# EAGLE design airu-schematic-bb-v1 (EAGLE 7.1.0)
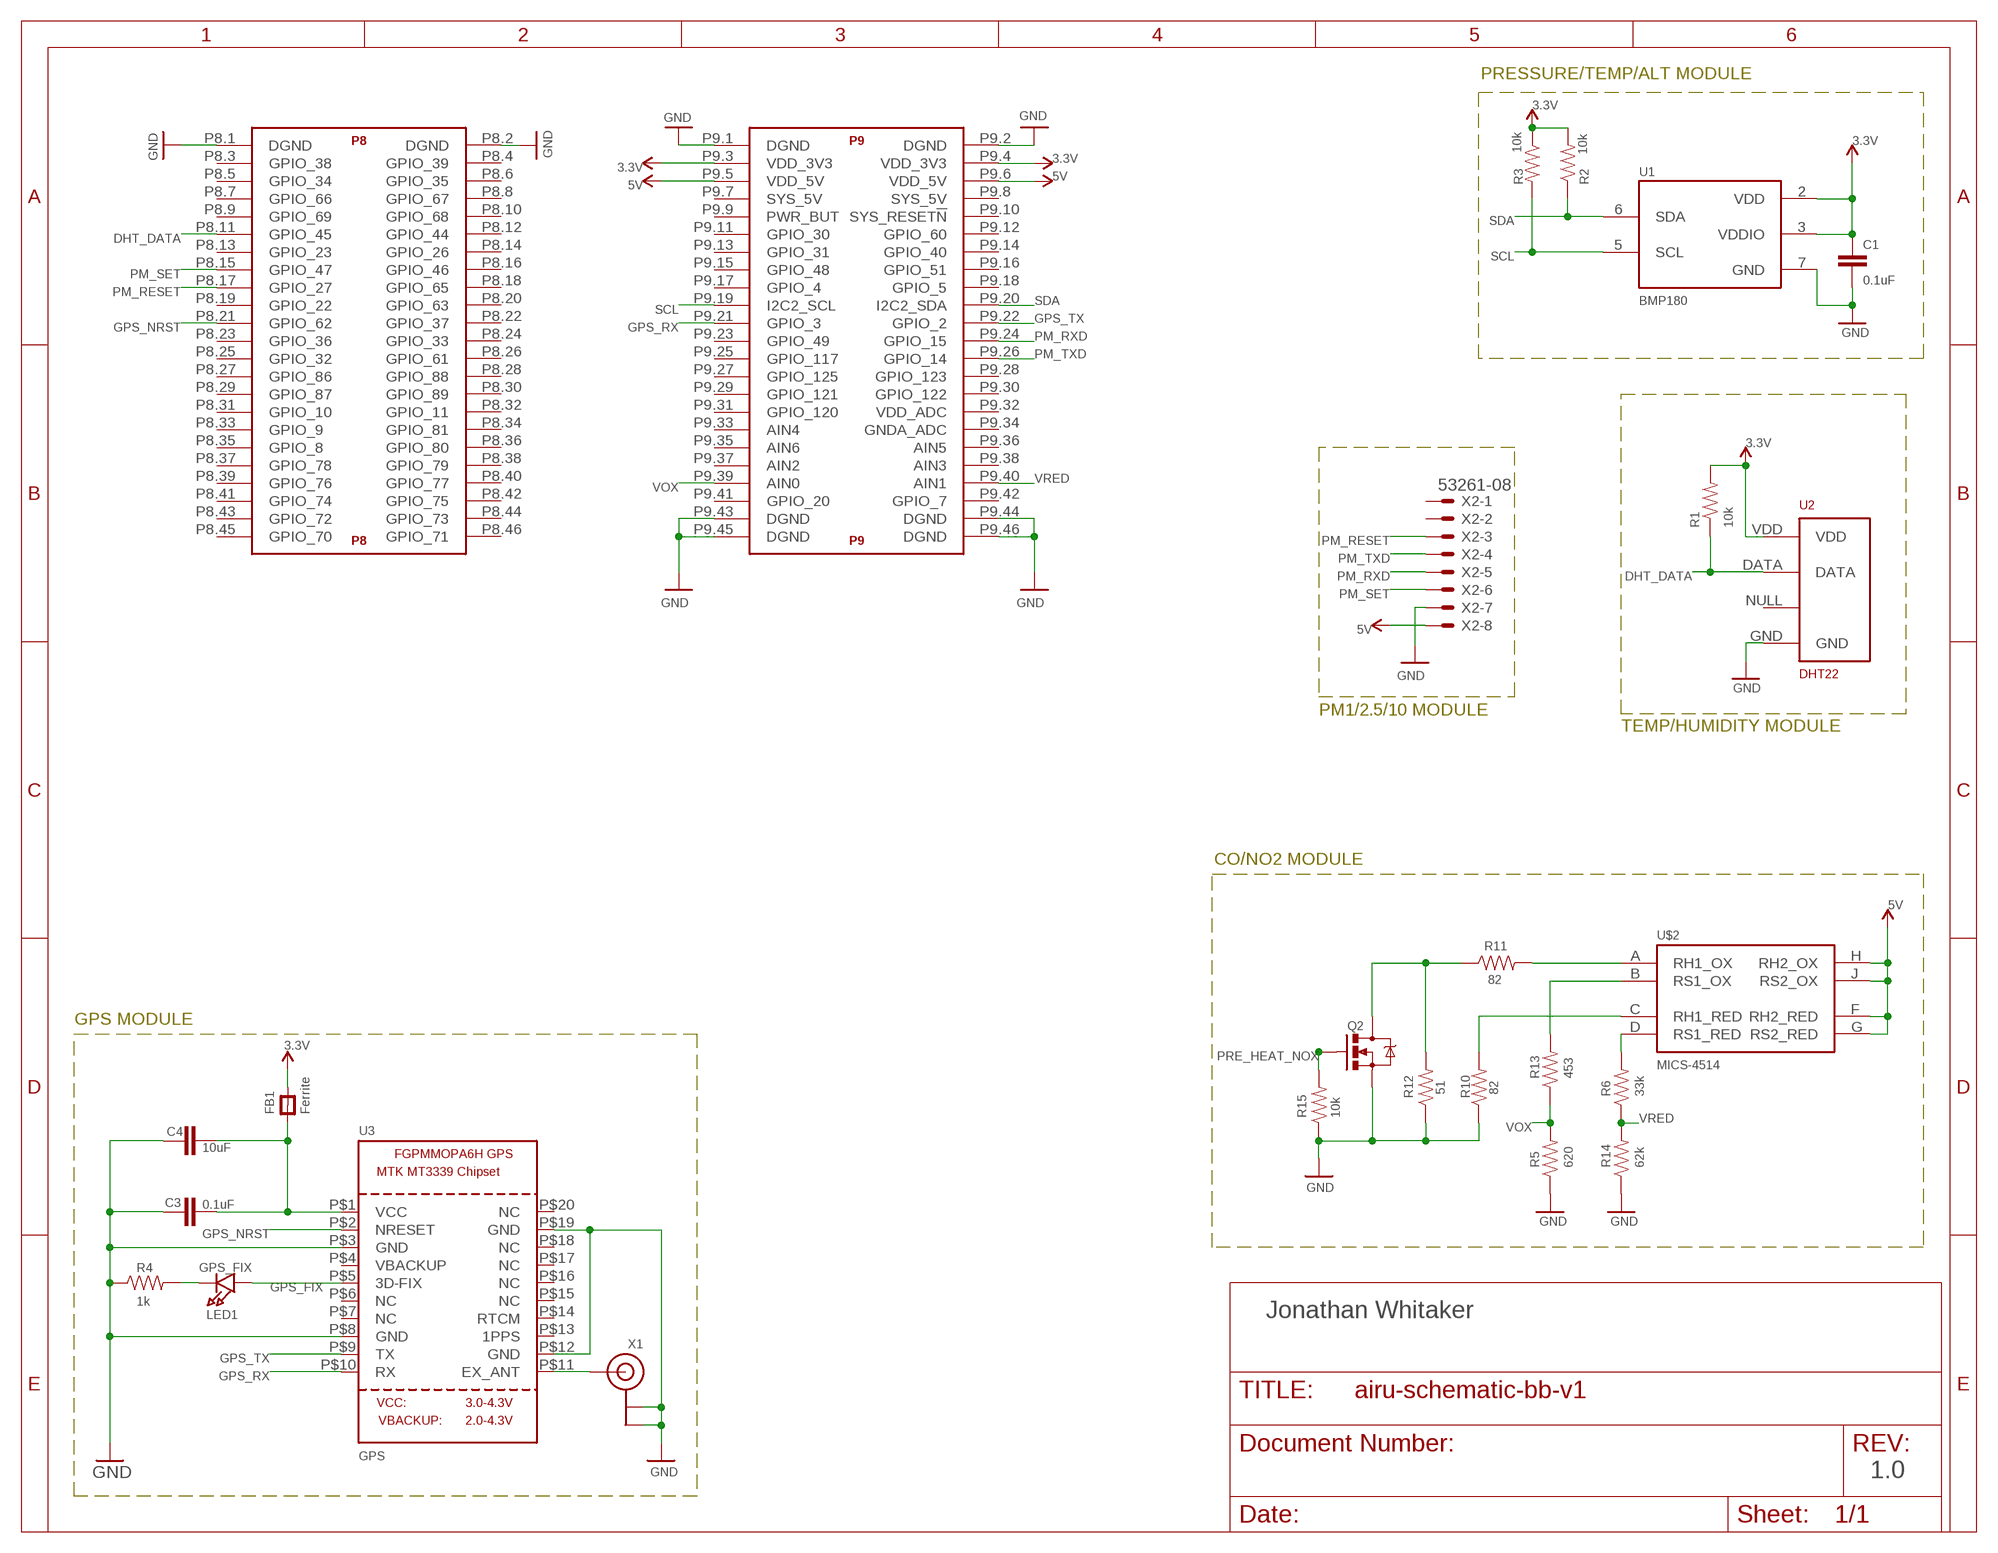
[diagram p0: schematic, sheet 1]

## Parts
C1  0.1uF  CAP1206  [1206]
C3  0.1uF  CAP1206  [1206]
C4  10uF  CAP1206  [1206]
FB1  Ferrite  FERRITE0805  [0805]
LED1  GPS_FIX  LED1206  [CHIPLED_1206]
Q2  MOSFET-NCHANNELAO3404A  [SOT23-3]
R1  10k  RESISTOR1206  [1206]
R2  10k  RESISTOR1206  [1206]
R3  10k  RESISTOR1206  [1206]
R4  1k  RESISTOR1206  [1206]
R5  620  RESISTOR1206  [1206]
R6  33k  RESISTOR1206  [1206]
R10  82  RESISTOR1206  [1206]
R11  82  RESISTOR1206  [1206]
R12  51  RESISTOR1206  [1206]
R13  453  RESISTOR1206  [1206]
R14  62k  RESISTOR1206  [1206]
R15  10k  RESISTOR1206  [1206]
U1  BMP180  [BMP180]
U2  DHT22  RHT03_DHT-22_AM2302  [RHT03_DHT-22]
U3  GPS  GPS_FGPMMOPA6H  [FGPMMOPA6H]
U$1  BEAGLE_BONE_BLACK_CAPE  [BEAGLE_BONE_BLACK_CAPE]
U$2  MICS-4514  [MICS_10-SMD]
X1  ANTENNA_U.FL  [U.FL]
X2  53261-08  [53261-08]

## Nets
3.3V: C1.1 FB1.2 R1.2 R2.2 R3.1 U1.2(VDD) U1.3(VDDIO) U2.VDD U$1.P9.3(P9:VDD_3V3) U$1.P9.4(P9:VDD_3V3) ; supply symbol labelled VCC
5V: U$1.P9.5(P9:VDD_5V) U$1.P9.6(P9:VDD_5V) U$2.F(RH2_RED) U$2.G(RS2_RED) U$2.H(RH2_OX) U$2.J(RS2_OX) X2.8 ; supply symbol labelled VCC
DHT_DATA [DHT22 GND]: R1.1 U2.DATA U$1.P8.11(P8:GPIO_45)
GND [DHT22 GND]: C1.2 C3.1 C4.1 Q2.2(S) R4.1 R5.1 R10.1 R12.1 R14.1 R15.1 U1.7(GND) U2.GND U3.P$3(GND) U3.P$8(GND) U3.P$12(GND) U3.P$19(GND) U$1.P8.1(P8:DGND) U$1.P8.2(P8:DGND) U$1.P9.1(P9:DGND) U$1.P9.2(P9:DGND) U$1.P9.43(P9:DGND) U$1.P9.44(P9:DGND) U$1.P9.45(P9:DGND) U$1.P9.46(P9:DGND) X1.1(GND) X1.2(GND) X2.7
GPS_FIX: LED1.A U3.P$5(3D-FIX)
GPS_NRST: U3.P$2(NRESET) U$1.P8.21(P8:GPIO_62)
GPS_RX: U3.P$10(RX) U$1.P9.21(P9:GPIO_3)
GPS_TX: U3.P$9(TX) U$1.P9.22(P9:GPIO_2)
N$1: C3.2 C4.2 FB1.1 U3.P$1(VCC)
N$2: U3.P$11(EX_ANT) X1.3(SIGNAL)
N$3: LED1.C R4.2
N$4: R10.2 U$2.C(RH1_RED)
N$6: R13.2 U$2.B(RS1_OX)
N$7: Q2.3(D) R11.1 R12.2
N$8: R6.2 U$2.D(RS1_RED)
N$9: R11.2 U$2.A(RH1_OX)
PM_RESET: U$1.P8.17(P8:GPIO_27) X2.3
PM_RXD: U$1.P9.24(P9:GPIO_15) X2.5
PM_SET: U$1.P8.15(P8:GPIO_47) X2.6
PM_TXD: U$1.P9.26(P9:GPIO_14) X2.4
PRE_HEAT_NOX: Q2.1(G) R15.2
SCL: R3.2 U1.5(SCL) U$1.P9.19(P9:I2C2_SCL)
SDA [BMP180 SCL/SDA]: R2.1 U1.6(SDA) U$1.P9.20(P9:I2C2_SDA)
VOX: R5.2 R13.1 U$1.P9.39(P9:AIN0)
VRED: R6.1 R14.2 U$1.P9.40(P9:AIN1)
Unconnected: U2.NULL U3.P$4(VBACKUP) U3.P$6(NC) U3.P$7(NC) U3.P$13(1PPS) U3.P$14(RTCM) U3.P$15(NC) U3.P$16(NC) U3.P$17(NC) U3.P$18(NC) U3.P$20(NC) U$1.P8.3(P8:GPIO_38) U$1.P8.4(P8:GPIO_39) U$1.P8.5(P8:GPIO_34) U$1.P8.6(P8:GPIO_35) U$1.P8.7(P8:GPIO_66) U$1.P8.8(P8:GPIO_67) U$1.P8.9(P8:GPIO_69) U$1.P8.10(P8:GPIO_68) U$1.P8.12(P8:GPIO_44) U$1.P8.13(P8:GPIO_23) U$1.P8.14(P8:GPIO_26) U$1.P8.16(P8:GPIO_46) U$1.P8.18(P8:GPIO_65) U$1.P8.19(P8:GPIO_22) U$1.P8.20(P8:GPIO_63) U$1.P8.22(P8:GPIO_37) U$1.P8.23(P8:GPIO_36) U$1.P8.24(P8:GPIO_33) U$1.P8.25(P8:GPIO_32) U$1.P8.26(P8:GPIO_61) U$1.P8.27(P8:GPIO_86) U$1.P8.28(P8:GPIO_88) U$1.P8.29(P8:GPIO_87) U$1.P8.30(P8:GPIO_89) U$1.P8.31(P8:GPIO_10) U$1.P8.32(P8:GPIO_11) U$1.P8.33(P8:GPIO_9) U$1.P8.34(P8:GPIO_81) U$1.P8.35(P8:GPIO_8) U$1.P8.36(P8:GPIO_80) U$1.P8.37(P8:GPIO_78) U$1.P8.38(P8:GPIO_79) U$1.P8.39(P8:GPIO_76) U$1.P8.40(P8:GPIO_77) U$1.P8.41(P8:GPIO_74) U$1.P8.42(P8:GPIO_75) U$1.P8.43(P8:GPIO_72) U$1.P8.44(P8:GPIO_73) U$1.P8.45(P8:GPIO_70) U$1.P8.46(P8:GPIO_71) U$1.P9.7(P9:SYS_5V) U$1.P9.8(P9:SYS_5V) U$1.P9.9(P9:PWR_BUT) U$1.P9.10(P9:SYS_RESET!N) U$1.P9.11(P9:GPIO_30) U$1.P9.12(P9:GPIO_60) U$1.P9.13(P9:GPIO_31) U$1.P9.14(P9:GPIO_40) U$1.P9.15(P9:GPIO_48) U$1.P9.16(P9:GPIO_51) U$1.P9.17(P9:GPIO_4) U$1.P9.18(P9:GPIO_5) U$1.P9.23(P9:GPIO_49) U$1.P9.25(P9:GPIO_117) U$1.P9.27(P9:GPIO_125) U$1.P9.28(P9:GPIO_123) U$1.P9.29(P9:GPIO_121) U$1.P9.30(P9:GPIO_122) U$1.P9.31(P9:GPIO_120) U$1.P9.32(P9:VDD_ADC) U$1.P9.33(P9:AIN4) U$1.P9.34(P9:GNDA_ADC) U$1.P9.35(P9:AIN6) U$1.P9.36(P9:AIN5) U$1.P9.37(P9:AIN2) U$1.P9.38(P9:AIN3) U$1.P9.41(P9:GPIO_20) U$1.P9.42(P9:GPIO_7) X2.1 X2.2

## Notes on the sheet
- PRESSURE/TEMP/ALT MODULE
- PM1/2.5/10 MODULE
- TEMP/HUMIDITY MODULE
- CO/NO2 MODULE
- GPS MODULE
- Jonathan Whitaker
- 1.0

## Library data of the parts
C1 C3 C4 = SparkFun-Passives:CAP: Capacitor Standard 0603 ceramic capacitor, and 0.1" leaded capacitor.
FB1 = microbuilder:FERRITE: Ferrite Bead 0603 MMZ1608B121C - 120 Ohm @ 100MHz, 600mA, 0.15 Ohm DC Resistance - Digikey: 445-2164-1-ND BK1608HW121-T - 120 Ohm, 600mA Ferrite Chip - Digikey: 587-1876-2-ND 0805 HZ0805B272R-10 - 2.7K Ohm @ 100MHz, 200mA, 0.8 Ohm DC Resistance - Digikey: 240-2504-1-ND (see also Murata BLM21BD272SN1L) MMZ2012Y152B - 1.5K Ohm @ 100MHz, 500mA, 0.4 Ohm DC Resistance - Digikey: 445-1560-1-ND - Mainly for high frequency (80-400MHz) MMZ2012R102A - 1K Ohm @ 100MHz, 500mA, 0.3 Ohm DC Resistance - Digikey: 445-1555-2-ND - More general purpose (10-200MHz)
LED1 = microbuilder:LED: LED 0603 - 0603 Surface Mount Package 2mA: Green LED - Low Power (3.9mcd, 2ma, 1.7Vf) - Digikey: 475-2709-2-ND Orange LED - Low Power (9.8mcd, 2ma, 1.8Vf) - Digikey: 475-1194-2-ND Red LED - Low Power (5mcd, 2ma, 1.8Vf) - Digikey: 475-1195-2-ND Yellow LED - Low Power (7mcd, 2ma, 1.8Vf) - Digikey: 475-1196-2-ND 5mA: Blue LED - Low Power (17mcd, 5ma, 2.9Vf) - Digikey: LNJ937W8CRACT-ND 0805 - 0805 Surface Mount Package 2mA: Red LED (8.8mcd, 2mA, 1.8Vf, Clear) - Low Power [Digikey: 475-2510-1-ND] Green LED (5mcd, 2mA, 1.8Vf, Clear) - Low Power [Digikey: 475-2730-1-ND] Yellow LED (11.3mcd, 2mA, 1.8Vf, Clear) - Low Power [Digikey: 475-2555-1-ND] 20mA: Red LED (104mcd, 20mA, Diffused) - LS R976 [Digikey: 475-1278-6-ND] Red LED (12mcd, 20mA, 2.0Vf, Clear) - APT2012EC [Digikey: 754-1128-1-ND] Green LED (15mcd, 20mA, 2.2Vf, Clear) - APT2012GC [Digikey: 754-1131-1-ND] Orange LED (160mcd, 20mA, 2.1Vf, Clear) - APT2012SECK [Digikey: 754-1130-1-ND] 1206 - 1206 Surface Mount Package Green LED (26mcd, 20mA, Diffused) - LG N971 [Digikey: 475-1407-6-ND] Red LED (15mcd, 20mA, Diffused) - LH N974 [Digikey: 475-1416-6-ND]
Q2 = SparkFun-DiscreteSemi:MOSFET-NCHANNEL: Common NMOSFET Parts MFG P/N Store ID Prod ID FDD8780 TRANS-09984 SI7820DN TRANS-11055 FDS6630A IC-08089 2N7002PW TRANS-11151 FQP30N06L COM-10213 TRANS-10060 BSS123LT1G TRANS-08345 BSS138 TRANS-00830 BS170 2N7000; PROD_ID: TRAN-12988
R1-R6 R10-R15 = SparkFun-Passives:RESISTOR: Resistor Basic schematic elements and footprints for 0603, 1206, and PTH resistors.
U1 = SparkFun-Sensors:BMP180: BOSCH BMP180 DIGITAL BAROMETRIC PRESSURE SENSOR Web page: http://www.bosch-sensortec.com/en/homepage/products_3/environmental_sensors_1/bmp180_1/bmp180 Datasheet: http://ae-bst.resource.bosch.com/media/products/dokumente/bmp180/BST-BMP180-DS000-09.pdf The BMP180 is the function compatible successor of the BMP085, a new generation of high precision digital pressure sensors for consumer applications. The ultra-low power, low voltage electronics of the BMP180 is optimized for use in mobile phones, PDAs, GPS navigation devices and outdoor equipment. With a low altitude noise of merely 0.25m at fast conversion time, the BMP180 offers superior performance. The I2C interface allows for easy system integration with a microcontroller. The BMP180 is based on piezo-resistive technology for EMC robustness, high accuracy and linearity as well as long term stability. Key features: - Temperature measurement included - I2C interface - Fully calibrated - Pb-free, halogen-free and RoHS compliant, - MSL 1 Basic specs: Pressure range: 300 to 1100hPa (+9000m to -500m relating to sea level) Supply voltage: 1.8 to 3.6V (VDD), 1.62V to 3.6V (VDDIO) Package: LGA package with metal lid Small footprint: 3.6mm x 3.8mm Super-flat: 0.93mm height Low power: 5μA at 1 sample / sec. in standard mode Low noise: 0.06hPa (0.5m) in ultra low power mode, 0.02hPa (0.17m) advanced resolution mode Typical applications: - Enhancement of GPS navigation (dead-reckoning, slope detection, etc.) - In- and out-door navigation - Leisure and sports - Weather forecast - Vertical velocity indication (rise/sink speed)
U2 = RHT03_DHT-22_AM2302:RHT03_DHT-22_AM2302: RHT03 / DHT-22 / AM2302 Packages and symbol for the RHT03 / DHT-22 relative humidity and temperature sensor. Note: The AM2302 is a wired version of the DHT-22 which typically requires less clearance and is thus provided as a separate package.; PROD_ID: SEN-10167
U3 = adafruit:GPS_FGPMMOPA6H: GPS Module - MTK MT3339 Chipset, -165dBm sensitivity, 22 channels, 10Hz, auto-select external antenna options
U$1 = SparkFun-Boards:BEAGLE_BONE_BLACK_CAPE
U$2 = SparkFun-Sensors:MICS-4514: Metal oxide MEMS carbon monoxide (CO) and NOx sensor in an SMD package.; PROD_ID: COMP-12310
X1 = adafruit:ANTENNA_U.FL: U.FL Antenna Connector
X2 = con-molex:53?-08: CONNECTOR wire to board 1.25 mm (.049 inch) pitch header; OC_FARNELL: 1125376; OC_NEWARK: unknown

## Net classes
0 default: width 0.254 mm
1 ground: width 0.457 mm
2 vcc: width 0.457 mm
3 BMP180 GND: width 0.152 mm, clearance 0.152 mm
4 BMP180 SCL/SDA: width 0.127 mm, clearance 0.127 mm
5 DHT22 GND: width 0.003 mm, clearance 0.127 mm

## Board
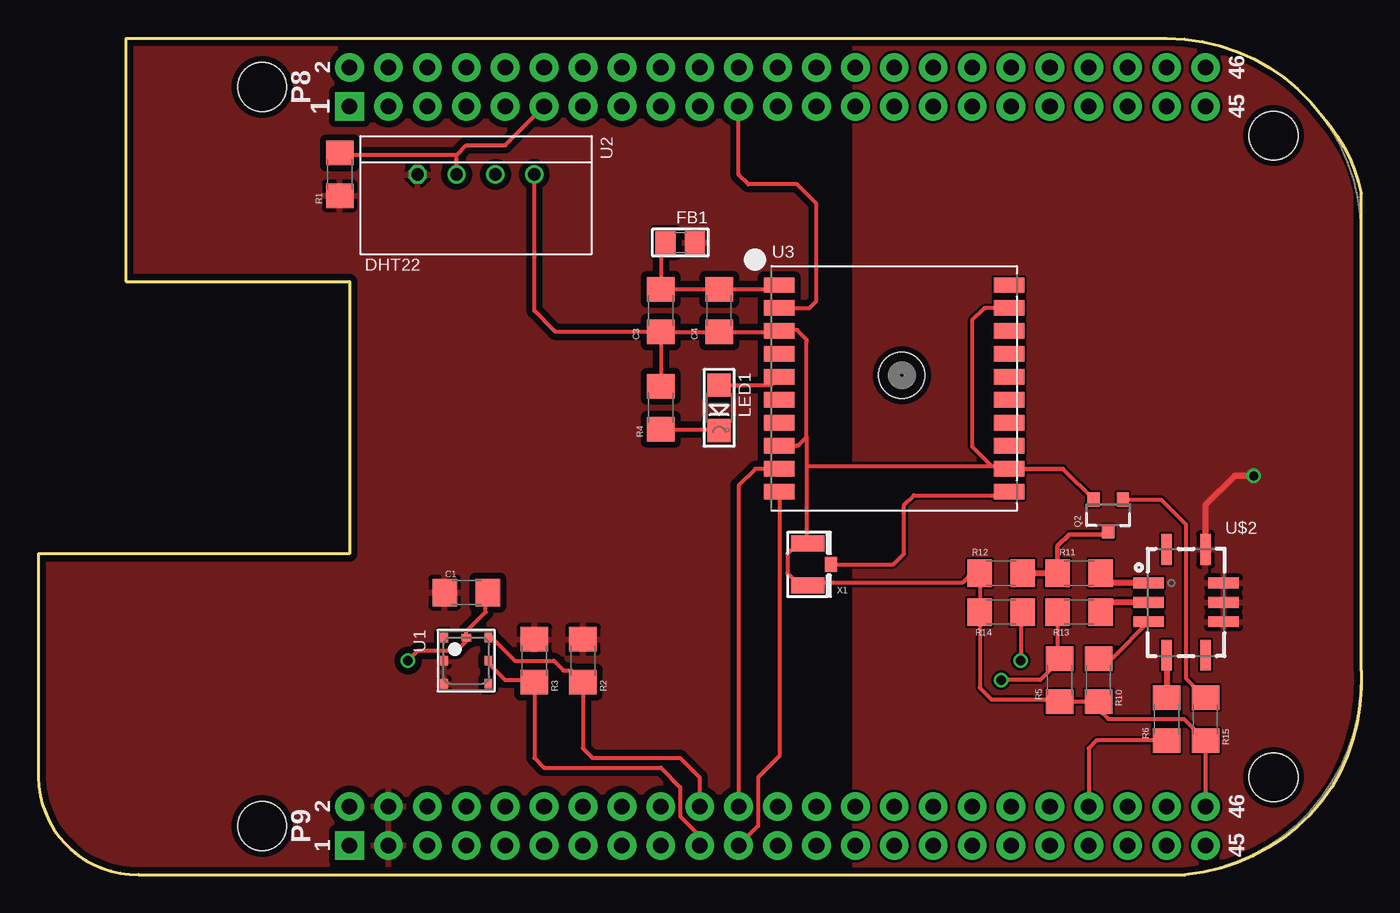
[diagram p1: board, top side]
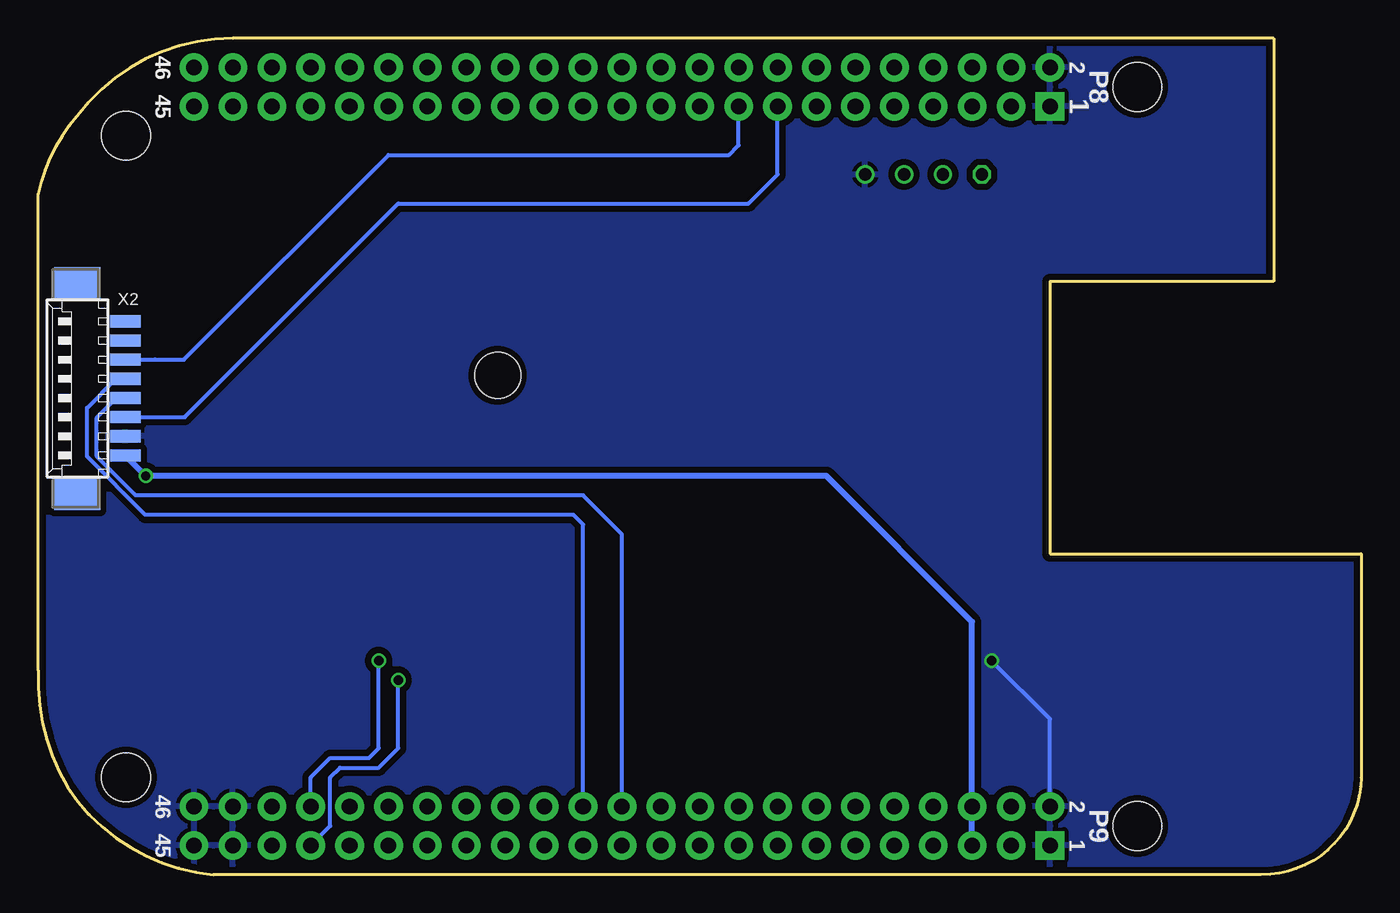
[diagram p2: board, bottom side, seen from below]

Size 86.37 x 54.61 mm. Coordinates in mm from the lower left corner, seen from the top.
Outline: 5.71,54.61 5.71,38.73 20.32,38.73 20.32,20.95 0,20.95 0,6.35 arc90 6.54,0 74.93,0 arc51 84.45,5.71 arc33 86.36,13.34 86.36,44.45 arc30 83.82,49.53 arc53 73.66,54.61 5.71,54.61
Copper layers (1*16): Top 0.0356mm / dielectric 1.5011mm / Bottom 0.0356mm
Design rules "osh-park": minimum track width 6mil, minimum drill 13mil, track to track 6mil, track to pad 6mil, pad to pad 6mil, via to via 6mil, smd to smd 6mil, copper to edge 15mil, drill to drill 6mil, minimum pad ring 7mil, minimum via ring 7mil, stop-mask expansion 3mil, vias tented up to drill 0mil, thermal gap 10mil

### Footprints (pad centres in the part's own frame; a part is rotated, then mirrored left to right if it is on the bottom)
1206 = smd 1.6 x 1.8: 1 -1.4,0; 2 1.4,0
0805 = smd 1.3 x 1.5: 1 -0.95,0; 2 0.95,0
CHIPLED_1206 = smd 1.5 x 1.5: A 0,-1.496; C 0,1.496
SOT23-3 = smd 0.8 x 0.9: 1 -0.95,-1; 2 0.95,-1; 3 0,1.1
BMP180 = smd 0.6 x 0.5: 1 1.5,1.45; 2 0,1.45; 3 -1.5,1.45; 4 -1.5,-1.45; 5 0,-1.45; 6 1.5,-1.45 | smd 0.5 x 0.6: 7 1.5,0
RHT03_DHT-22 = drill 0.8: DATA -1.27,0; GND 3.81,0; NULL 1.27,0 | drill 0.8 octagon: VDD -3.81,0
FGPMMOPA6H = smd 2 x 1: P$1 -7.5,6.75; P$2 -7.5,5.25; P$3 -7.5,3.75; P$4 -7.5,2.25; P$5 -7.5,0.75; P$6 -7.5,-0.75; P$7 -7.5,-2.25; P$8 -7.5,-3.75; P$9 -7.5,-5.25; P$10 -7.5,-6.75; P$11 7.5,-6.75; P$12 7.5,-5.25; P$13 7.5,-3.75; P$14 7.5,-2.25; P$15 7.5,-0.75; P$16 7.5,0.75; P$17 7.5,2.25; P$18 7.5,3.75; P$19 7.5,5.25; P$20 7.5,6.75 | hole 3: 0.5,0.85
BEAGLE_BONE_BLACK_CAPE = drill 1.016 pad 1.88 square: P8.1 20.32,50.165; P9.1 20.32,1.905 | drill 1.016 pad 1.88: P8.2 20.32,52.705; P8.3 22.86,50.165; P8.4 22.86,52.705; P8.5 25.4,50.165; P8.6 25.4,52.705; P8.7 27.94,50.165; P8.8 27.94,52.705; P8.9 30.48,50.165; P8.10 30.48,52.705; P8.11 33.02,50.165; P8.12 33.02,52.705; P8.13 35.56,50.165; P8.14 35.56,52.705; P8.15 38.1,50.165; P8.16 38.1,52.705; P8.17 40.64,50.165; P8.18 40.64,52.705; P8.19 43.18,50.165; P8.20 43.18,52.705; P8.21 45.72,50.165; P8.22 45.72,52.705; P8.23 48.26,50.165; P8.24 48.26,52.705; P8.25 50.8,50.165; P8.26 50.8,52.705; P8.27 53.34,50.165; P8.28 53.34,52.705; P8.29 55.88,50.165; P8.30 55.88,52.705; P8.31 58.42,50.165; P8.32 58.42,52.705; P8.33 60.96,50.165; P8.34 60.96,52.705; P8.35 63.5,50.165; P8.36 63.5,52.705; P8.37 66.04,50.165; P8.38 66.04,52.705; P8.39 68.58,50.165; P8.40 68.58,52.705; P8.41 71.12,50.165; P8.42 71.12,52.705; P8.43 73.66,50.165; P8.44 73.66,52.705; P8.45 76.2,50.165; P8.46 76.2,52.705; P9.2 20.32,4.445; P9.3 22.86,1.905; P9.4 22.86,4.445; P9.5 25.4,1.905; P9.6 25.4,4.445; P9.7 27.94,1.905; P9.8 27.94,4.445; P9.9 30.48,1.905; P9.10 30.48,4.445; P9.11 33.02,1.905; P9.12 33.02,4.445; P9.13 35.56,1.905; P9.14 35.56,4.445; P9.15 38.1,1.905; P9.16 38.1,4.445; P9.17 40.64,1.905; P9.18 40.64,4.445; P9.19 43.18,1.905; P9.20 43.18,4.445; P9.21 45.72,1.905; P9.22 45.72,4.445; P9.23 48.26,1.905; P9.24 48.26,4.445; P9.25 50.8,1.905; P9.26 50.8,4.445; P9.27 53.34,1.905; P9.28 53.34,4.445; P9.29 55.88,1.905; P9.30 55.88,4.445; P9.31 58.42,1.905; P9.32 58.42,4.445; P9.33 60.96,1.905; P9.34 60.96,4.445; P9.35 63.5,1.905; P9.36 63.5,4.445; P9.37 66.04,1.905; P9.38 66.04,4.445; P9.39 68.58,1.905; P9.40 68.58,4.445; P9.41 71.12,1.905; P9.42 71.12,4.445; P9.43 73.66,1.905; P9.44 73.66,4.445; P9.45 76.2,1.905; P9.46 76.2,4.445 | hole 3.175: 14.605,3.175; 80.645,6.35; 80.645,48.26; 14.605,51.435
MICS_10-SMD = smd 0.7 x 2: A 1.27,2.45; B 0,2.45; C -1.27,2.45; F -1.27,-2.45; G 0,-2.45; H 1.27,-2.45 | smd 2 x 0.7: D -3.45,1.27; E -3.45,-1.27; J 3.45,-1.27; K 3.45,1.27
U.FL = smd 2.2 x 1.05: 1 0,1.375; 2 0,-1.375 | smd 0.8 x 1: 3 1.525,0
53261-08 = smd 0.8 x 2: 1 4.375,-2.5; 2 3.125,-2.5; 3 1.875,-2.5; 4 0.625,-2.5; 5 -0.625,-2.5; 6 -1.875,-2.5; 7 -3.125,-2.5; 8 -4.375,-2.5 | smd 2.1 x 3: S1 6.875,0.625; S2 -6.875,0.625

### Placement (x,y rotation side)
C1  27.94,18.41 0 top
C3  40.64,36.83 90 top
C4  44.45,36.83 90 top
FB1  41.91,41.27 0 top
LED1  44.45,30.48 180 top
Q2  69.85,23.5 180 top
R1  19.68,45.72 270 top
R2  35.56,13.97 90 top
R3  32.38,13.97 270 top
R4  40.64,30.48 270 top
R5  66.67,12.7 90 top
R6  73.66,10.16 90 top
R10  69.22,12.7 90 top
R11  67.94,19.68 0 top
R12  62.87,19.68 0 top
R13  67.94,17.14 0 top
R14  62.87,17.14 0 top
R15  76.2,10.16 90 top
U1  27.94,13.97 90 top
U2  28.57,45.72 0 top
U3  55.88,31.75 0 top
U$1  0,0 0 top
U$2  74.93,17.78 90 top
X1  50.23,20.26 0 top
X2  83.19,31.75 90 bottom

### Tracks (layer width: path | path; a pad name or v marks a point on that pad's centre or on a via)
3.3V
  pour Top (isolate 0.406): 0,54.61 52.07,54.61 52.07,0 0,0
5V  (via drill 0.6)
  Top 0.406: v79.34,26.04 78.11,26.04 76.2,24.13 U$2.J
  Bottom 0.406: U$1.P9.6 25.4,3.81 | U$1.P9.6 25.4,5.08 25.4,16.51 34.92,26.04 v79.34,26.04 X2.8 | U$1.P9.5 U$1.P9.6
  pour Top: 53.34,54.61 86.36,54.61 86.36,0 53.34,0
DHT_DATA
  Top 0.254: U2.DATA 27.3,46.99 | 27.3,46.99 27.94,47.62 30.48,47.62 U$1.P8.11 | 27.3,46.99 19.82,46.99 R1.1
GND  (via drill 0.6)
  Top 0.254: v24.13,13.97 24.77,14.61 27.3,14.61 27.94,15.24 U1.7 27.94,15.88 29.21,17.14 29.21,18.29 C1.2 | C3.1 C4.1 48.31,35.43 arc90 U3.P$3 arc-45 48.52,35.56 49.53,35.56 50.09,35 arc-45 50.16,34.82 50.16,28.57 | C3.1 33.89,35.43 arc-45 33.71,35.5 32.38,36.83 U2.GND | C3.1 R4.1 | U3.P$8 49.48,28 arc45 49.66,28.07 50.16,28.57 | U3.P$19 61.87,37 arc45 61.69,36.93 60.96,36.2 60.96,28.05 arc45 61.03,27.87 62.23,26.67 | 62.23,26.67 63.1,26.67 | 63.1,26.67 arc-45 63.28,26.6 | 62.23,26.67 50.23,26.67 50.16,26.61 | 63.1,26.67 arc-45 63.28,26.6 | 63.28,26.6 U3.P$12 | 66.89,26.5 Q2.2 68.53,24.13 | U$1.P9.46 R15.1 74.8,10.16 69.85,10.16 69.22,10.79 R10.1 R5.1 66.55,11.43 62.23,11.43 61.47,12.2 R14.1 R12.1 60.96,19.68 60.33,19.05 50.4,19.05 X1.2 50.06,19.05 49.53,19.05 48.9,19.68 48.9,20.95 49.57,21.63 X1.1 50.16,21.7 50.16,26.61 | 50.16,28.57 50.16,26.61
  Top 0.305: U3.P$12 66.89,26.5
  Bottom 0.254: U$1.P9.2 20.32,10.16 v24.13,13.97
  pour Bottom (isolate 0.406): 0,54.61 86.36,54.61 86.36,0 0,0
GPS_FIX
  Top 0.254: LED1.A 47.86,31.98 U3.P$5
GPS_NRST
  Top 0.254: U3.P$2 50.34,37 50.8,37.47 50.8,43.81 49.53,45.09 46.35,45.09 45.72,45.72 U$1.P8.21
GPS_RX
  Top 0.254: U3.P$10 48.38,7.74 46.99,6.35 46.99,3.17 U$1.P9.21
GPS_TX
  Top 0.254: U3.P$9 46.82,26.5 45.72,25.4 U$1.P9.22
N$1
  Top 0.254: FB1.1 40.89,41.27 arc90 40.64,41.02 C3.2 C4.2 48.13,38.23 arc90 48.38,38.48 U3.P$1
N$2
  Top 0.254: U3.P$11 63.15,24.77 57.15,24.77 56.52,24.13 56.52,20.95 55.82,20.26 X1.3
N$3
  Top 0.254: R4.2 44.35,29.08 LED1.C
N$4
  Top 0.254: R10.2 69.29,14.12 70.1,14.12 72.44,16.46 U$2.C
N$6
  Top 0.406: U$2.B 69.98,17.78 R13.2
N$7
  Top 0.305: R11.1 66.55,21.46 67.31,22.23 69.68,22.23 Q2.3
  Top 0.406: R12.2 R11.1
N$8
  Top 0.406: U$2.D R6.2
N$9
  Top 0.406: U$2.A 69.98,19.05 R11.2
PM_RESET
  Bottom 0.254: X2.3 78.74,33.62 | 78.74,33.62 78.74,33.66 | 78.74,33.62 76.86,33.62 63.5,46.99 41.27,46.99 40.64,47.62 U$1.P8.17
PM_RXD
  Bottom 0.254: U$1.P9.24 48.26,22.23 50.8,24.77 80.01,24.77 82.55,27.3 82.55,29.84 81.28,31.11 X2.5
PM_SET
  Bottom 0.254: X2.6 76.81,29.88 62.87,43.81 40.01,43.81 38.1,45.72 U$1.P8.15
PM_TXD
  Bottom 0.254: U$1.P9.26 50.8,22.86 51.44,23.5 79.38,23.5 83.19,27.3 83.19,30.48 81.28,32.38 X2.4
PRE_HEAT_NOX
  Top 0.254: Q2.1 73.3,24.5 74.93,22.86 74.93,12.83 R15.2
SCL
  Top 0.254: U1.5 29.39,13.79 30.48,12.7 32.26,12.7 R3.2 32.38,7.62 33.02,6.99 40.64,6.99 41.91,5.71 41.91,3.81 43.18,2.54 U$1.P9.19
SDA
  Top 0.254: U1.6 29.61,15.47 31.11,13.97 33.66,13.97 34.29,13.34 34.8,13.34 R2.1 35.56,8.26 36.2,7.62 41.91,7.62 43.18,6.35 U$1.P9.20
VOX  (via drill 0.6)
  Top 0.254: R13.1 66.55,14.23 R5.2 66.67,13.97 65.41,12.7 v62.87,12.7
  Bottom 0.254: U$1.P9.39 67.31,3.17 67.31,6.35 66.67,6.99 64.14,6.99 62.87,8.26 v62.87,12.7
VRED  (via drill 0.6)
  Top 0.254: R14.2 64.14,17.14 v64.14,13.97 | R6.1 69.08,8.76 68.58,8.26 U$1.P9.40
  Bottom 0.254: U$1.P9.40 68.58,6.35 67.31,7.62 64.77,7.62 64.14,8.26 v64.14,13.97

### Text on the board
tDocu: V1.0 | 02/2016 / Jonathan Whitaker